# EAGLE schematic DRV8825 (EAGLE 7.1.0)
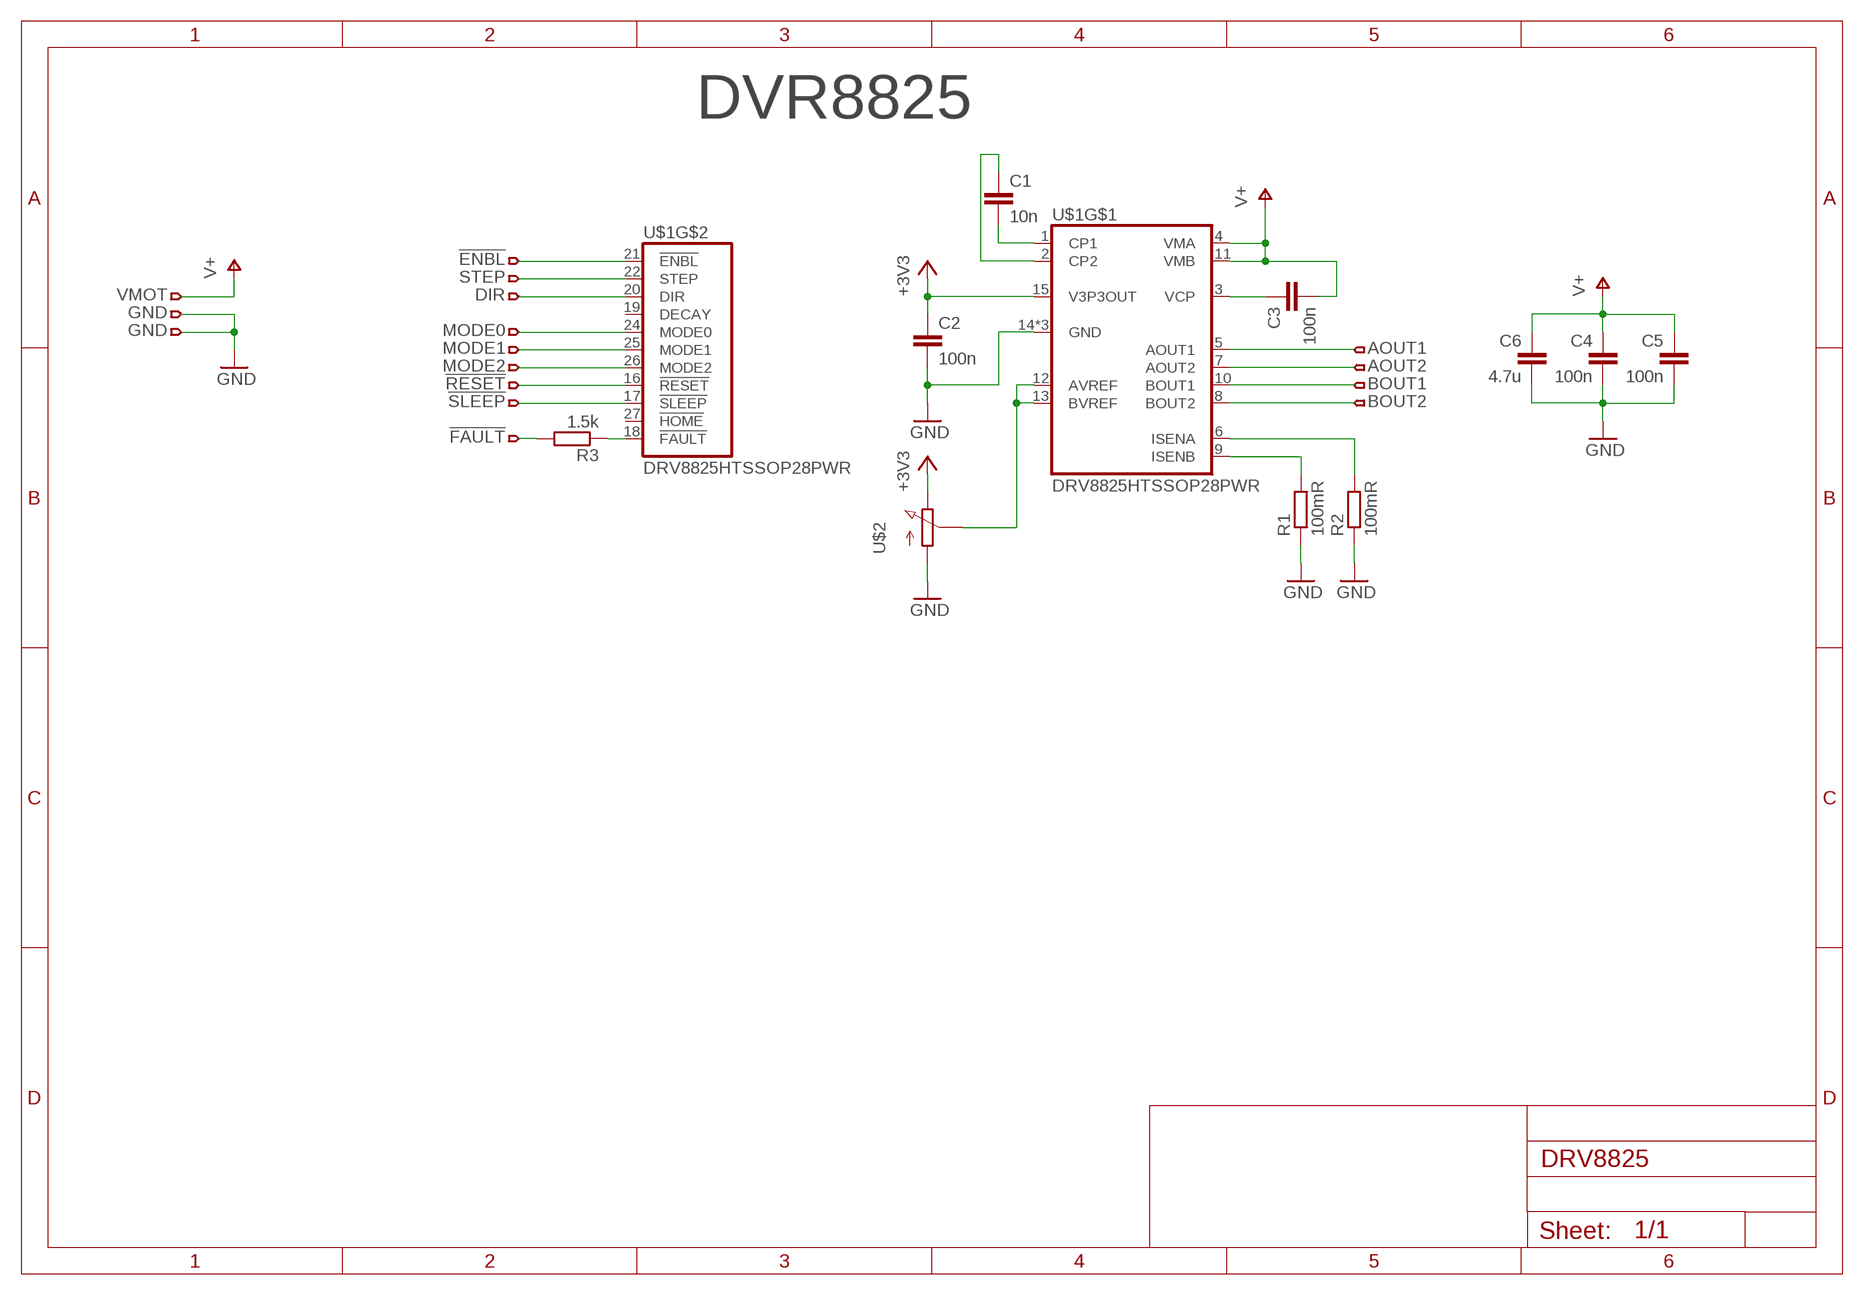
[diagram p0: schematic, sheet 1]

## Parts
C1  10n  C-EUC0603  [C0603]
C2  100n  C-EUC0603  [C0603]
C3  100n  C-EUC0603  [C0603]
C4  100n  C-EUC0603  [C0603]
C5  100n  C-EUC0603  [C0603]
C6  4.7u  C-EUC0603  [C0603]
JP3  AOUT1  PINHD-1X1_2.54  [1X01]
JP4  AOUT2  PINHD-1X1_2.54  [1X01]
JP5  BOUT1  PINHD-1X1_2.54  [1X01]
JP6  BOUT2  PINHD-1X1_2.54  [1X01]
JP7  !ENBL  PINHD-1X1_2.54  [1X01]
JP8  STEP  PINHD-1X1_2.54  [1X01]
JP9  DIR  PINHD-1X1_2.54  [1X01]
JP10  VMOT  PINHD-1X1_2.54  [1X01]
JP11  MODE0  PINHD-1X1_2.54  [1X01]
JP12  MODE1  PINHD-1X1_2.54  [1X01]
JP13  MODE2  PINHD-1X1_2.54  [1X01]
JP14  !RESET  PINHD-1X1_2.54  [1X01]
JP15  !SLEEP  PINHD-1X1_2.54  [1X01]
JP16  GND  PINHD-1X1_2.54  [1X01]
JP17  !FAULT  PINHD-1X1_2.54  [1X01]
JP18  GND  PINHD-1X1_2.54  [1X01]
R1  100mR  R-EU_R0603  [R0603]
R2  100mR  R-EU_R0603  [R0603]
R3  1.5k  R-EU_R0603  [R0603]
U$1  DRV8825HTSSOP28PWR  [HTSSOP28PWP]
U$2  POT-PVZ3A  [PVZ3A]

## Nets
+3V3: C2.1 U$1.15(V3P3OUT) U$2.P$3(E)
GND: C2.2 C4.2 C5.2 C6.2 JP16.1(PA0) JP18.1(PA0) R1.1 R2.1 U$1.14(GND) U$1.28(GND) U$1.EXP(GND) U$2.P$1(A)
N$1: C1.2 U$1.1(CP1)
N$2: C1.1 U$1.2(CP2)
N$3: R3.1 U$1.18(!FAULT)
N$4: U$1.12(AVREF) U$1.13(BVREF) U$2.P$2(S)
N$5: C3.1 U$1.3(VCP)
N$6: R1.2 U$1.9(ISENB)
N$7: R2.2 U$1.6(ISENA)
N$8: JP3.1(PA0) U$1.5(AOUT1)
N$9: JP4.1(PA0) U$1.7(AOUT2)
N$10: JP5.1(PA0) U$1.10(BOUT1)
N$11: JP6.1(PA0) U$1.8(BOUT2)
N$12: JP7.1(PA0) U$1.21(!ENBL)
N$13: JP8.1(PA0) U$1.22(STEP)
N$14: JP9.1(PA0) U$1.20(DIR)
N$16: JP11.1(PA0) U$1.24(MODE0)
N$17: JP12.1(PA0) U$1.25(MODE1)
N$18: JP13.1(PA0) U$1.26(MODE2)
N$19: JP14.1(PA0) U$1.16(!RESET)
N$20: JP15.1(PA0) U$1.17(!SLEEP)
N$22: JP17.1(PA0) R3.2
V+: C3.2 C4.1 C5.1 C6.1 JP10.1(PA0) U$1.4(VMA) U$1.11(VMB)
Unconnected: U$1.19(DECAY) U$1.27(!HOME)

## Notes on the sheet
- DVR8825

## Library data of the parts
C1-C6 = rcl:C-EU: CAPACITOR, European symbol
JP3-JP18 = Carlos2014:PINHD-1X1: PIN HEADER
R1-R3 = rcl:R-EU_: RESISTOR, European symbol
U$1 = carlos2016:DRV8825
U$2 = Carlos2014:POT